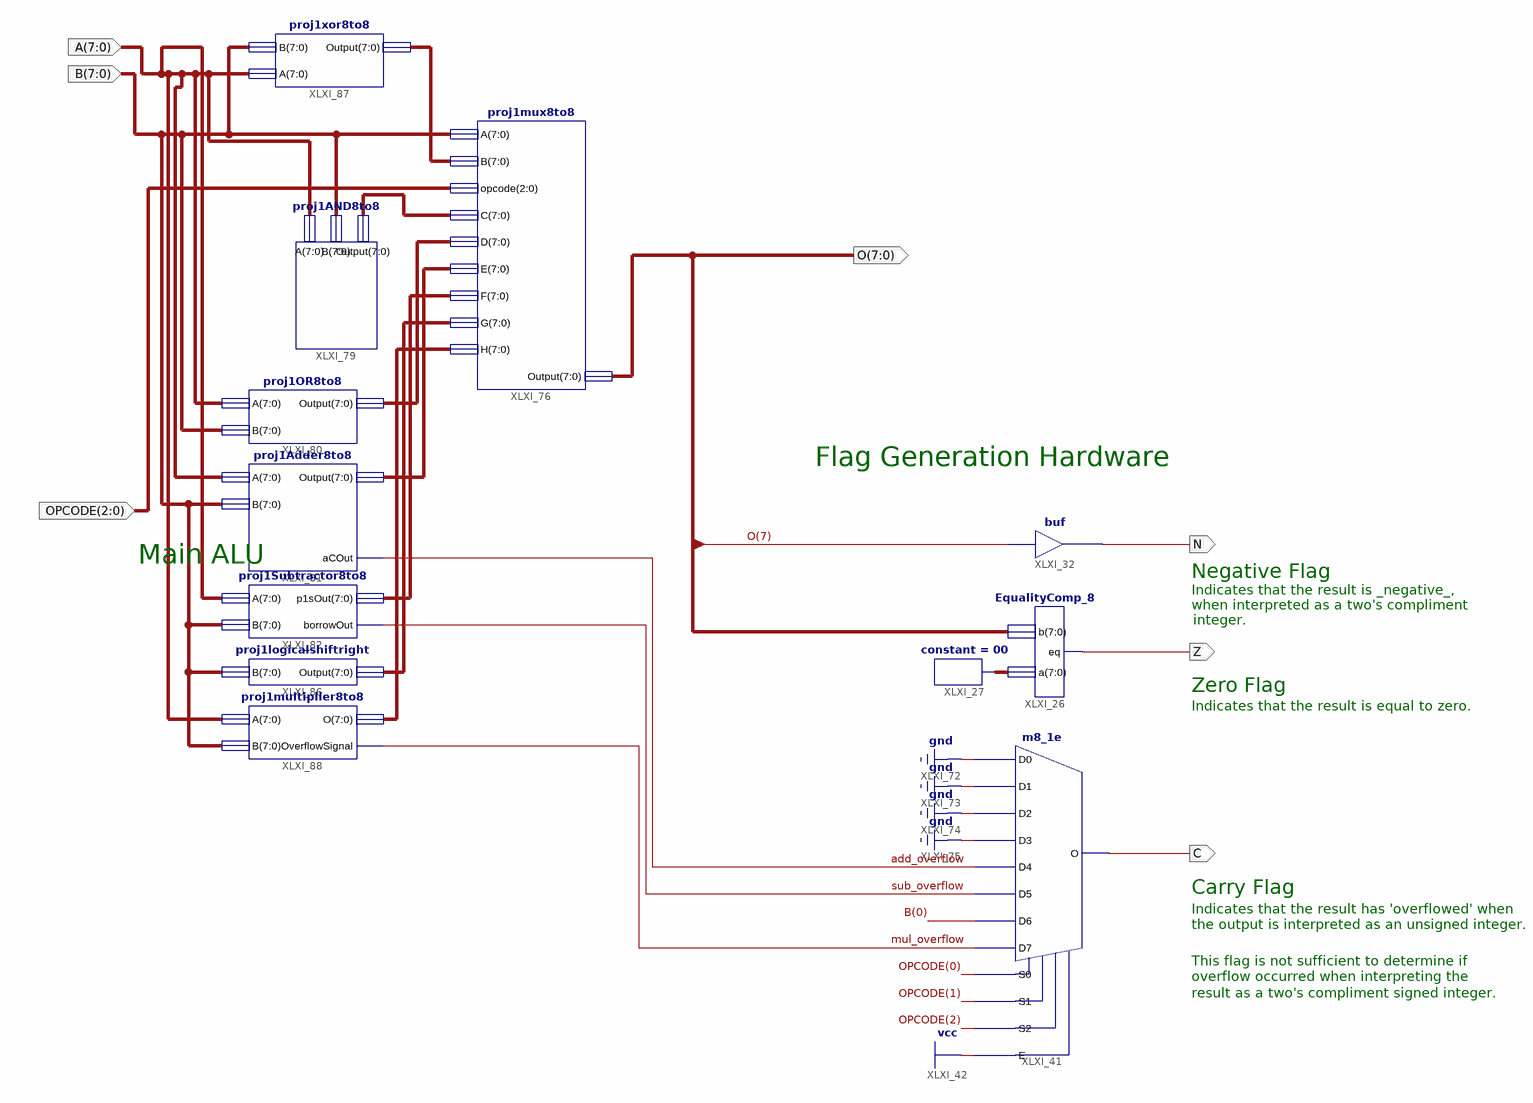
[diagram p0: schematic sheet 1]
// Xilinx ISE schematic ALU.sch (spartan6) as structural Verilog: 12 symbols, 7 ports
module ALU (
  input  [7:0] B,
  input  [7:0] A,
  input  [2:0] OPCODE,
  output [7:0] O,
  output C,
  output Z,
  output N
);

  wire add_overflow, mul_overflow, sub_overflow;
  wire [7:0] XLXN_55, XLXN_165, XLXN_168, XLXN_171, XLXN_172, XLXN_175, XLXN_179, XLXN_182;

  EqualityComp_8 XLXI_26 (.a(XLXN_55), .b(O), .eq(Z));
  constant #(.CValue("00")) XLXI_27 (.O(XLXN_55));
  m8_1e XLXI_41 (
    .D0(1'b0), .D1(1'b0), .D2(1'b0), .D3(1'b0), .D4(add_overflow), .D5(sub_overflow), .D6(B[0]),
    .D7(mul_overflow), .E(1'b1), .S0(OPCODE[0]), .S1(OPCODE[1]), .S2(OPCODE[2]), .O(C));
  buf XLXI_32 (N, O[7]);
  proj1mux8to8 XLXI_76 (
    .A(B), .B(XLXN_165), .opcode(OPCODE), .C(XLXN_168), .D(XLXN_171), .E(XLXN_172), .F(XLXN_175),
    .G(XLXN_179), .H(XLXN_182), .Output(O));
  proj1AND8to8 XLXI_79 (.A(A), .B(B), .Output(XLXN_168));
  proj1OR8to8 XLXI_80 (.A(A), .B(B), .Output(XLXN_171));
  proj1Adder8to8 XLXI_81 (.A(A), .B(B), .Output(XLXN_172), .aCOut(add_overflow));
  proj1Subtractor8to8 XLXI_82 (.A(A), .B(B), .p1sOut(XLXN_175), .borrowOut(sub_overflow));
  proj1logicalshiftright XLXI_86 (.B(B), .Output(XLXN_179));
  proj1xor8to8 XLXI_87 (.B(B), .A(A), .Output(XLXN_165));
  proj1multiplier8to8 XLXI_88 (.A(A), .B(B), .O(XLXN_182), .OverflowSignal(mul_overflow));

  // Notes on the sheet:
  //   Flag Generation Hardware
  //   Main ALU
  //   Negative Flag
  //   Indicates that the result is _negative_,
  //   when interpreted as a two's compliment
  //   integer.
  //   Zero Flag
  //   Indicates that the result is equal to zero.
  //   Carry Flag
  //   Indicates that the result has 'overflowed' when
  //   the output is interpreted as an unsigned integer.
  //   This flag is not sufficient to determine if
  //   overflow occurred when interpreting the
  //   result as a two's compliment signed integer.
endmodule
